# EAGLE design main_v2 (EAGLE 7.7.0)
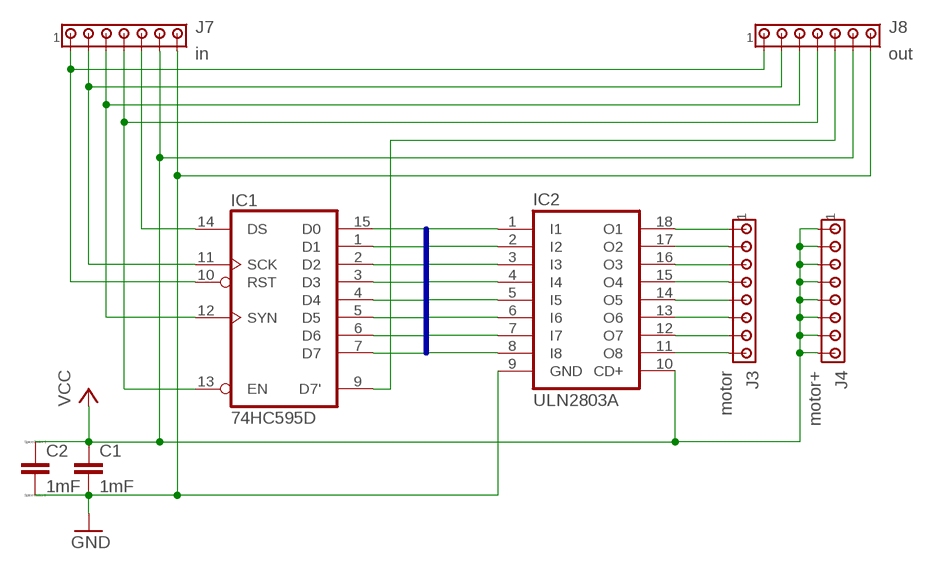
[diagram p0: schematic, sheet 1]

## Parts
C1  1mF  C5/2.5  [C5B2.5]
C2  1mF  CC0402  [C0402]
IC1  74HC595D  [SO16]
IC2  ULN2803A  ULN2803ASO18W  [SO18W]
J3  motor  MTA08-100  [10X08MTA]
J4  motor+  MTA08-100  [10X08MTA]
J7  in  MTA07-100  [10X07MTA]
J8  out  MTA07-100  [10X07MTA]

## Nets
D1: IC1.15(D0) IC2.8(I8)
D2: IC1.1(D1) IC2.7(I7)
D3: IC1.2(D2) IC2.6(I6)
D4: IC1.3(D3) IC2.5(I5)
D5: IC1.4(D4) IC2.4(I4)
D6: IC1.5(D5) IC2.3(I3)
D7: IC1.6(D6) IC2.2(I2)
D8: IC1.7(D7) IC2.1(I1)
GND: C1.2 C2.2 IC2.9(GND) J7.7 J8.7
N$1: IC1.13(EN) J7.4 J8.4
N$2: IC1.12(SYN) J7.3 J8.3
N$3: IC1.11(SCK) J7.2 J8.2
N$9: IC1.10(RST) J7.1 J8.1
N$12: IC1.14(DS) J7.5
N$13: IC1.9(D7') J8.5
N$14: IC2.18(O1) J3.1
N$15: IC2.17(O2) J3.2
N$16: IC2.16(O3) J3.3
N$17: IC2.15(O4) J3.4
N$18: IC2.14(O5) J3.5
N$19: IC2.13(O6) J3.6
N$20: IC2.12(O7) J3.7
N$21: IC2.11(O8) J3.8
VCC: C1.1 C2.1 IC2.10(CD+) J4.1 J4.2 J4.3 J4.4 J4.5 J4.6 J4.7 J4.8 J7.6 J8.6

## Buses
D[1..8]

## Power pins joined to a net without a drawn wire
GND: IC1.8(GND)
VCC: IC1.16(VCC)

## Library data of the parts
C1 = capacitor-wima:C: CAPACITOR naming: grid - package width
C2 = eagle-ltspice:C: CAPACITOR, European symbol; SPICEMODEL: NONE; SPICEPREFIX: C
IC1 = 74xx-eu:74*595: 8-bit SHIFT REGISTER, output latch
IC2 = uln-udn:ULN2803A: DRIVER ARRAY
J3 J4 = con-amp:MTA08-100: AMP connector
J7 J8 = con-amp:MTA07-100: AMP connector

## Board
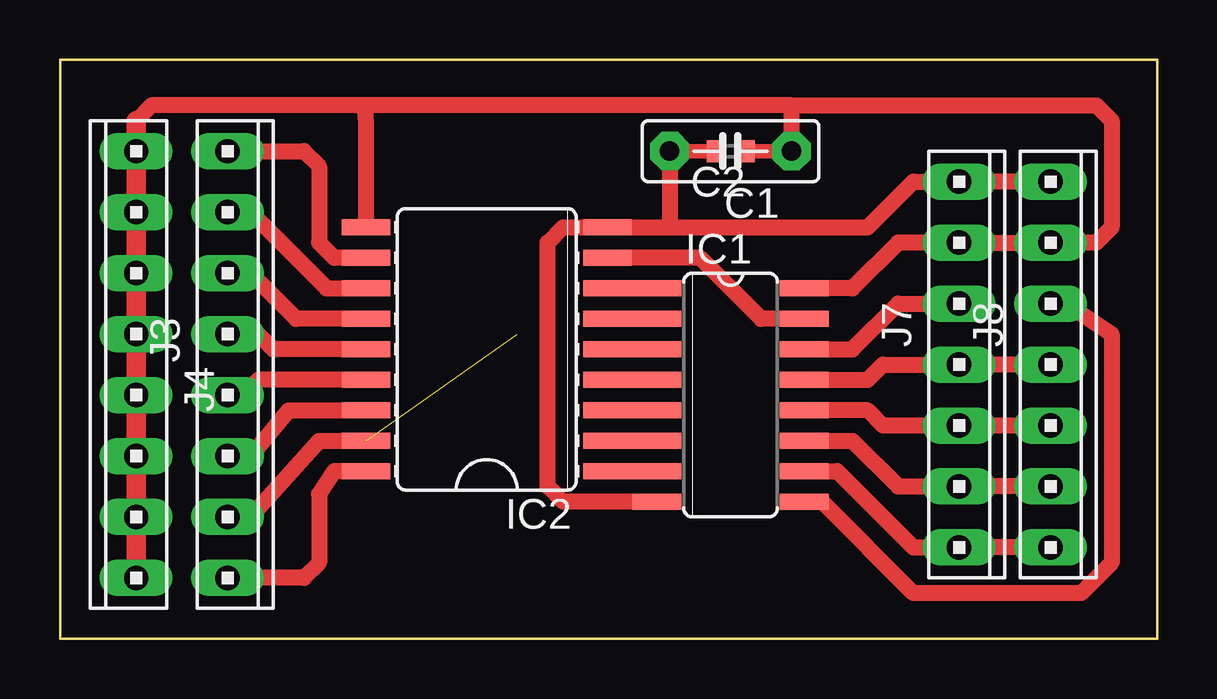
[diagram p1: board, top side]
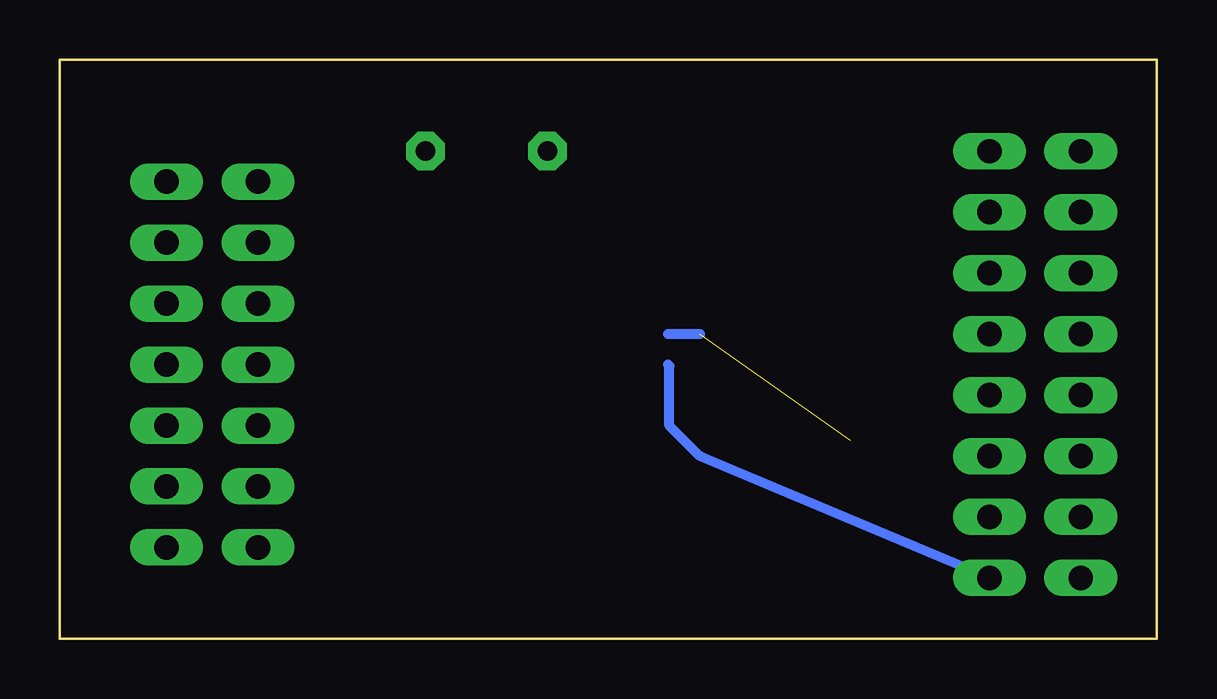
[diagram p2: board, bottom side, seen from below]

Size 45.71 x 24.12 mm. Coordinates in mm from the lower left corner, seen from the top.
Outline: 0,0 45.71,0 45.71,24.12 0,24.12 0,0
Copper layers (1*16): Top 0.035mm / dielectric 1.5mm / Bottom 0.035mm
Design rules "default": minimum track width 10mil, minimum drill 24mil, track to track 8mil, track to pad 8mil, pad to pad 8mil, via to via 8mil, smd to smd 8mil, copper to edge 40mil, drill to drill 8mil, minimum pad ring 10mil, minimum via ring 8mil, stop-mask expansion 4mil, vias tented up to drill 0mil, thermal gap 10mil
Milling: 4 lines

### Footprints (pad centres in the part's own frame; a part is rotated, then mirrored left to right if it is on the bottom)
C5B2.5 = drill 0.813 pad 1.6 octagon: 1 -2.54,0; 2 2.54,0
C0402 = smd 0.7 x 0.9: 1 -0.65,0; 2 0.65,0
SO16 = smd 0.66 x 2.032: 1 -4.445,-3.073; 2 -3.175,-3.073; 3 -1.905,-3.073; 4 -0.635,-3.073; 5 0.635,-3.073; 6 1.905,-3.073; 7 3.175,-3.073; 8 4.445,-3.073; 9 4.445,3.073; 10 3.175,3.073; 11 1.905,3.073; 12 0.635,3.073; 13 -0.635,3.073; 14 -1.905,3.073; 15 -3.175,3.073; 16 -4.445,3.073
SO18W = smd 0.66 x 2.032: 1 -5.08,-5.029; 2 -3.81,-5.029; 3 -2.54,-5.029; 4 -1.27,-5.029; 5 0,-5.029; 6 1.27,-5.029; 7 2.54,-5.029; 8 3.81,-5.029; 9 5.08,-5.029; 10 5.08,5.029; 11 3.81,5.029; 12 2.54,5.029; 13 1.27,5.029; 14 0,5.029; 15 -1.27,5.029; 16 -2.54,5.029; 17 -3.81,5.029; 18 -5.08,5.029
10X08MTA = drill 1.016 long: 1 8.89,0; 2 6.35,0; 3 3.81,0; 4 1.27,0; 5 -1.27,0; 6 -3.81,0; 7 -6.35,0; 8 -8.89,0
10X07MTA = drill 1.016 long: 1 7.62,0; 2 5.08,0; 3 2.54,0; 4 0,0; 5 -2.54,0; 6 -5.08,0; 7 -7.62,0

### Placement (x,y rotation side)
C1  27.94,20.32 180 top
C2  27.94,20.32 180 top
IC1  27.94,10.16 270 top
IC2  17.78,12.06 90 top
J3  6.99,11.43 270 top
J4  3.17,11.43 90 top
J7  37.47,11.43 270 top
J8  41.27,11.43 270 top

### Tracks (layer width: path | path; a pad name or v marks a point on that pad's centre or on a via)
D1
  Top 0.66: IC1.15 29.21,13.34 26.67,15.88 IC2.8
D2
  Top 0.66: IC1.1 IC2.7
D3
  Top 0.66: IC1.2 IC2.6
D4
  Top 0.66: IC1.3 IC2.5
D5
  Top 0.66: IC1.4 IC2.4
D6
  Top 0.66: IC1.5 IC2.3
D7
  Top 0.66: IC1.6 IC2.2
D8
  Top 0.66: IC1.7 IC2.1
GND
  Top 0.61: C2.2 C1.2
  Top 0.66: J8.7 J7.7 35.56,19.05 33.66,17.14 25.4,17.14 | IC1.8 20.95,5.71 20.32,6.35 20.32,16.51 20.95,17.14 IC2.9 25.4,17.14 | C1.2 25.4,17.14
N$1
  Top 0.66: IC1.13 33.66,10.79 34.29,11.43 J7.4 J8.4
N$2
  Top 0.66: IC1.12 33.66,9.53 34.29,8.89 J7.3 J8.3
N$3
  Top 0.66: IC1.11 33.02,8.26 34.92,6.35 J7.2 J8.2
N$9
  Top 0.66: J8.1 J7.1 35.56,3.81 32.38,6.99 IC1.10
N$12
  Top 0.66: IC1.14 33.02,12.06 34.92,13.97 J7.5
N$13
  Top 0.66: J8.5 41.91,13.97 43.81,12.7 43.81,3.17 42.55,1.91 35.56,1.91 31.75,5.71 IC1.9
N$14
  Top 0.406: 12.06,6.99 IC2.18
  Top 0.66: 12.06,6.99 11.43,6.99 10.79,6.03 10.79,3.17 10.16,2.54 J3.1
  Bottom 0.406: J3.1 19.05,7.62 20.32,8.89 20.32,11.38 20.37,11.43
N$15  (1 unrouted)
  Top 0.66: IC2.17 10.79,8.26 7.94,5.08 J3.2
  Bottom 0.406: 19.05,12.7 20.37,12.7
N$16
  Top 0.66: IC2.16 9.53,9.53 7.94,7.62 J3.3
N$17
  Top 0.66: IC2.15 8.26,10.79 7.62,10.16 J3.4
N$18
  Top 0.66: IC2.14 8.89,12.06 8.26,12.7 J3.5
N$19
  Top 0.66: IC2.13 9.84,13.34 7.94,15.24 J3.6
N$20
  Top 0.66: IC2.12 11.11,14.61 7.94,17.78 J3.7
N$21
  Top 0.406: 12.06,15.88 IC2.11
  Top 0.66: J3.8 10.16,20.32 10.79,19.68 10.79,16.51 11.43,15.88 12.06,15.88
VCC
  Top 0.61: C2.1 C1.1
  Top 0.66: 12.7,22.23 3.81,22.23 3.17,21.59 | IC1.16 33.02,14.61 34.92,16.51 J7.6 J8.6 43.18,16.51 43.81,17.14 43.81,21.59 43.18,22.23 30.48,22.23 | IC2.10 12.75,21.54 12.7,22.23 | 30.48,22.23 12.7,22.23 | C1.1 30.48,22.23
  Top 0.813: J4.8 J4.7 J4.6 J4.5 J4.4 J4.3 J4.2 J4.1 3.17,21.59